# EasyEDA Pro project portalhub.epro

# Schematic Schematic1
Board Name: Board1; Create Date: 2026-05-30; Page Name: P1; Project Name: usbgobrr; Schematic Name: Schematic1; Update Date: 2026-05-30; Company: EasyEDA.com; Page Size: A4; Version: V1.0
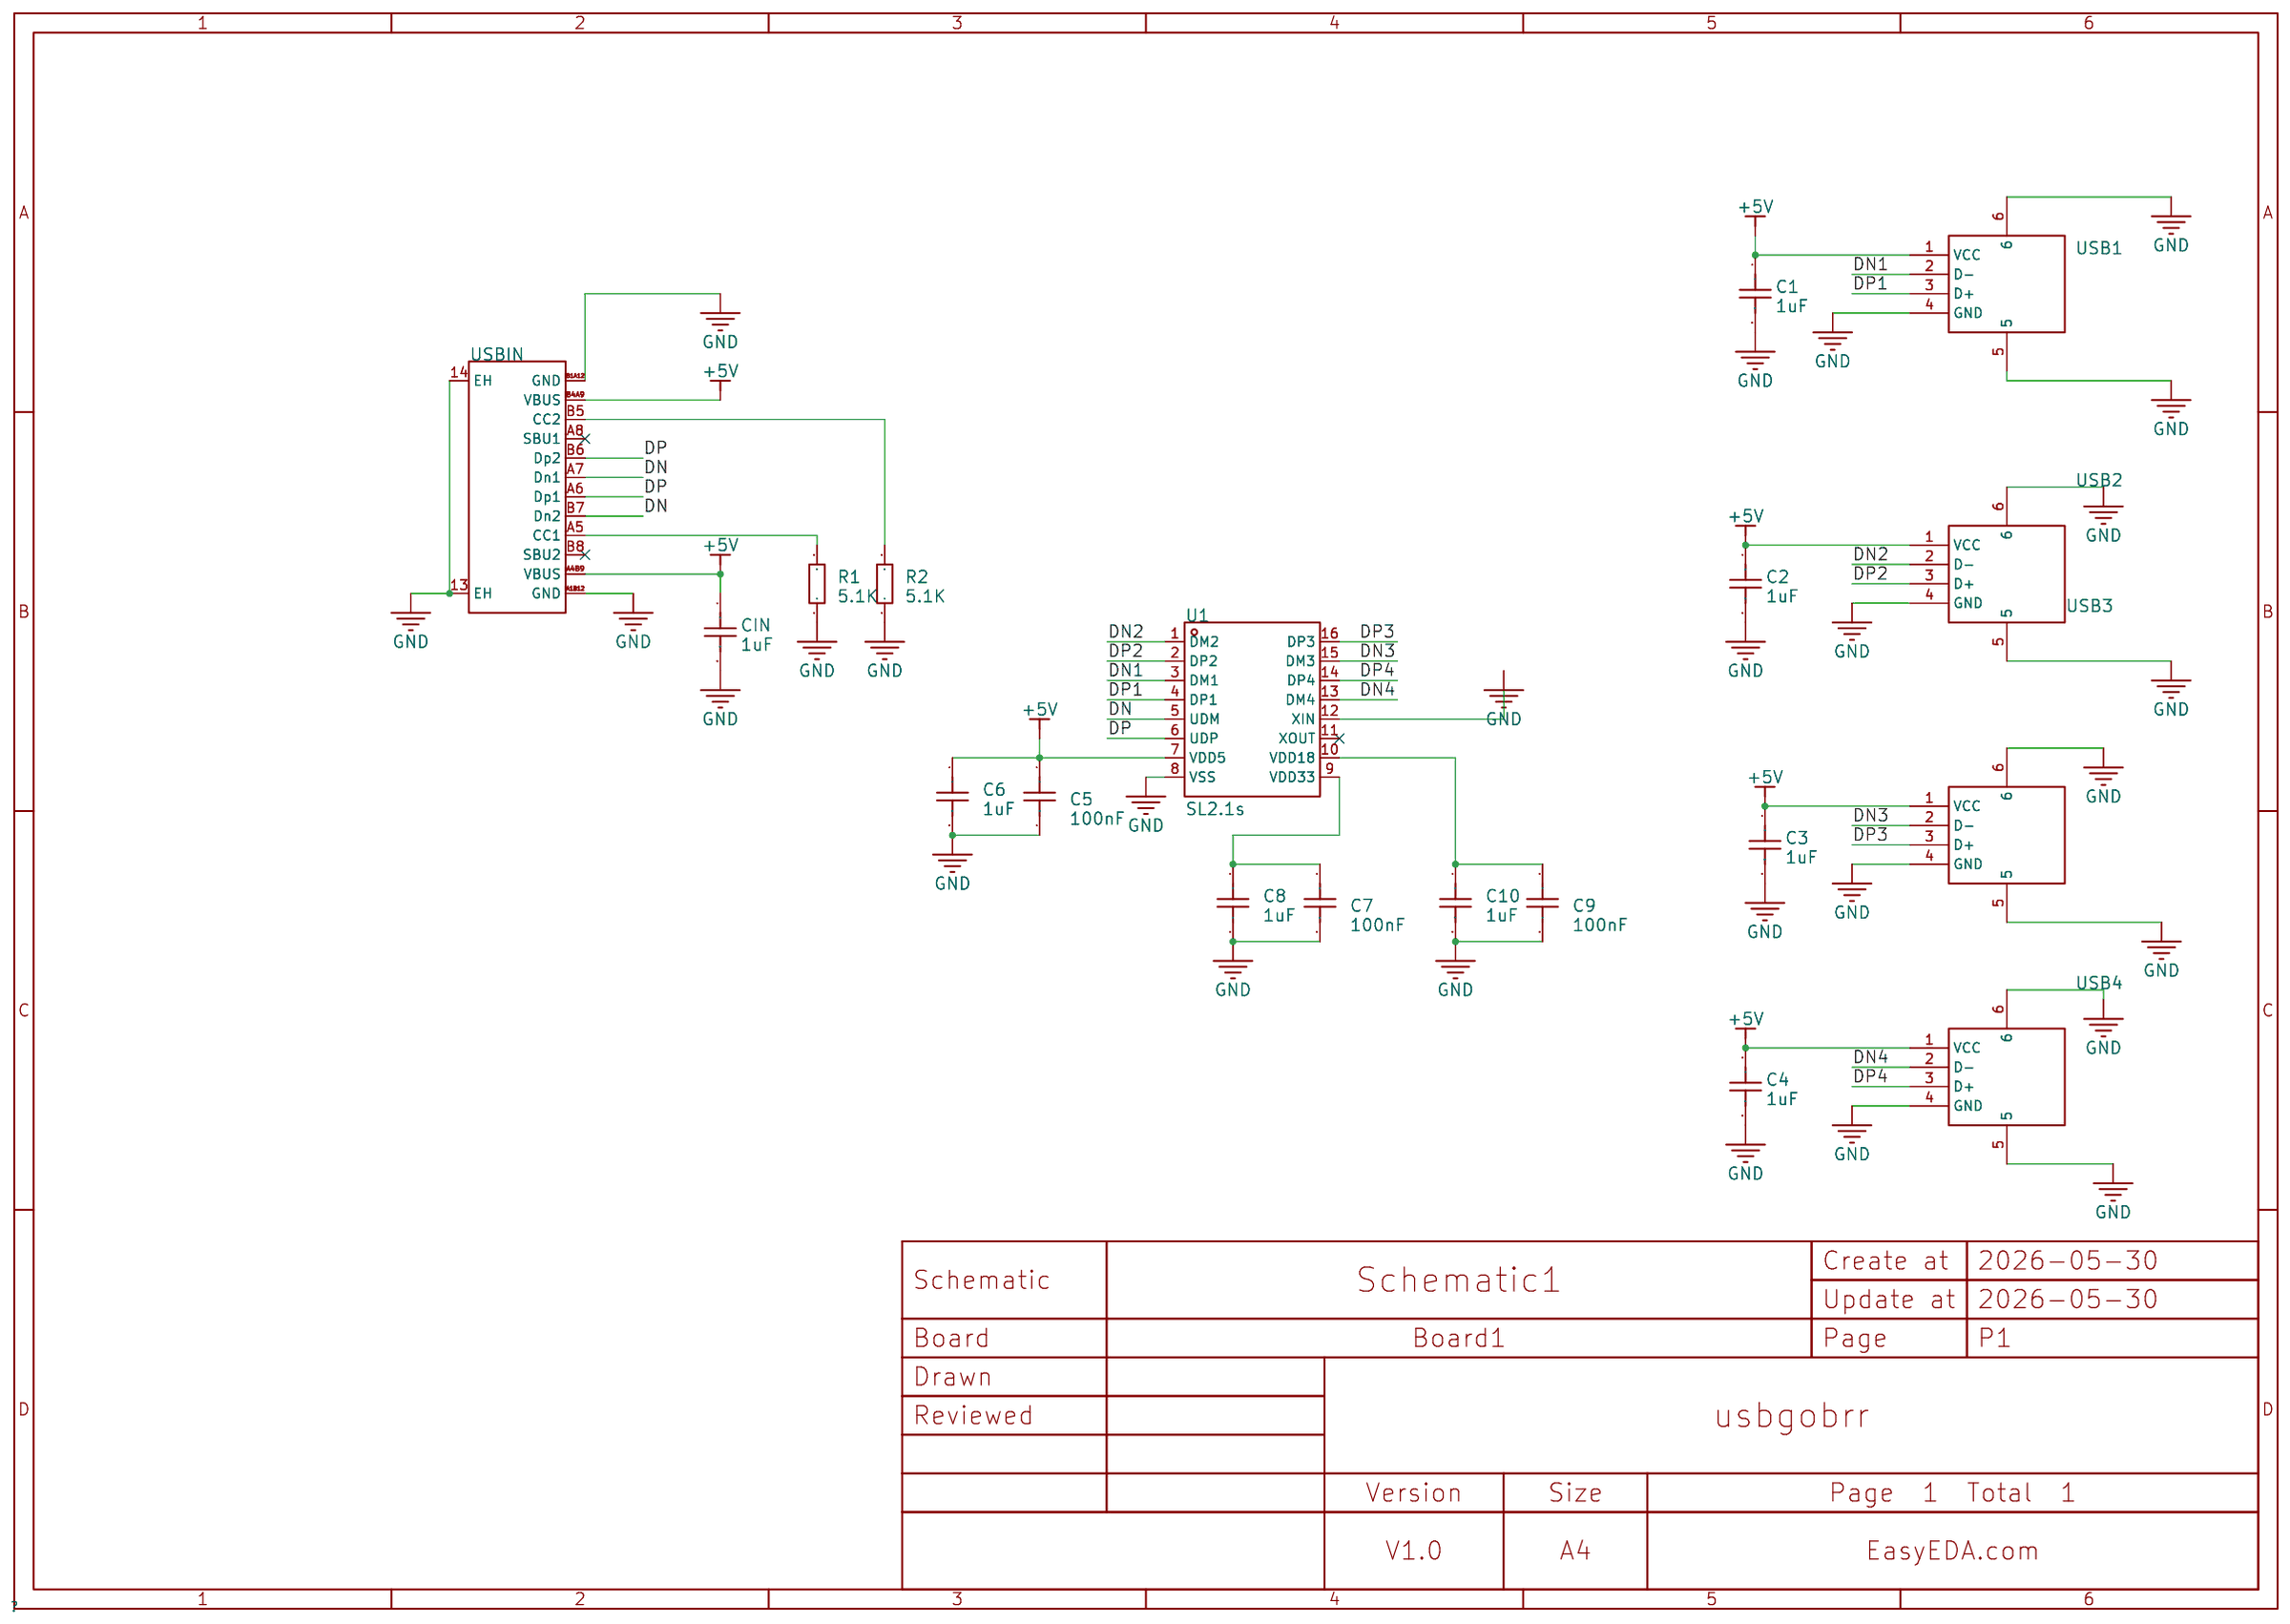
[diagram p0: schematic sheet]

## Parts
C1  1uF  [C0603]
C2  1uF  [C0603]
C3  1uF  [C0603]
C4  1uF  [C0603]
C5  100nF  [C0603]
C6  1uF  [C0603]
C7  100nF  [C0603]
C8  1uF  [C0603]
C9  100nF  [C0603]
C10  1uF  [C0603]
CIN  1uF  [C0603]
R1  5.1K  [R0603]
R2  5.1K  [R0603]
U1  SL2.1s  [SSOP-16_L4.6-W2.6-P0.53-LS4.0-BL]
USB1  10.0 QHHTZB6.3  [USB-A-TH_10.0QHHTZB6.3]
USB2  10.0 QHHTZB6.3  [USB-A-TH_10.0QHHTZB6.3]
USB3  10.0 QHHTZB6.3  [USB-A-TH_10.0QHHTZB6.3]
USB4  10.0 QHHTZB6.3  [USB-A-TH_10.0QHHTZB6.3]
USBIN  TYPE-C 16PIN 2MD(073)  [USB-C-SMD_TYPE-C-16PIN-2MD-073]

## Library data of the parts
C1-C10 CIN = CAP_0603: Supplier Footprint: 0603
R1 R2 = Res_0603: Supplier Footprint: 0603
U1 = SL2.1s: type:Hub USB Protocol:USB 2.0 Data Rate:- Voltage - Supply:4V~5.25V Voltage - Supply:4V~5.25V Operating Temperature:0℃~+70℃ Operating Temperature:0℃~+70℃ Memory Interface:- Current - Supply:120mA Quiescent Supply Current:2.5mA Number of Channels:4; LCSC Part Name: USB2.0 HUB控制器集成电路; Supplier Part: C2684433; Manufacturer: CoreChips(和芯润德); Supplier Footprint: SSOP-16; JLCPCB Part Class: Extended Part; Datasheet: https://item.szlcsc.com/datasheet/SL2.1s/2782346.html; Supplier: LCSC; type: Hub; USB Protocol: USB 2.0; Voltage - Supply: 4V~5.25V; Operating Temperature: 0℃~+70℃; Current - Supply: 120mA; Quiescent Supply Current: 2.5mA; Number of Channels: 4
USB1-USB4 = 10.0 QHHTZB6.3: Connector Type:Type-A Protocol Standard:USB 2.0 Gender:Female Mounting Type:Surface Mount, Right Angle Number of Contacts:4P Number of Ports:1 Current Rating-Power:1.5A Voltage Rating:30V Connect-Disconnect Life:5,000 times Supplementary Features:- Center; LCSC Part Name: 壳长10.0mm; Supplier Part: C668591; Manufacturer: SHOU HAN(首韩); Supplier Footprint: SMD; JLCPCB Part Class: Extended Part; Datasheet: https://item.szlcsc.com/datasheet/10.0%2520QHHTZB6.3/698534.html; Supplier: LCSC; Connector Type: Type-A; Protocol Standard: USB 2.0; Gender: Female; Mounting Type: Surface Mount, Right Angle; Number of Contacts: 4P; Number of Ports: 1; Current Rating-Power: 1.5A; Voltage Rating: 30V; Connect-Disconnect Life: 5,000 times; Length: 10mm; Detection color: Black; Operating Temperature: -25℃~+85℃
USBIN = TYPE-C 16PIN 2MD(073): Connector Type:Type-C Protocol Standard:- Gender:Female Mounting Type:Surface Mount, Right Angle Number of Contacts:16P Number of Ports:1 Current Rating-Power:3A Voltage Rating:5V Connect-Disconnect Life:10,000 Cycles Supplementary Features:- Center Heigh; LCSC Part Name: Type-C 母 卧贴; Supplier Part: C2765186; Manufacturer: SHOU HAN(首韩); Supplier Footprint: SMD; JLCPCB Part Class: Extended Part; Datasheet: https://item.szlcsc.com/datasheet/TYPE-C%252016PIN%25202MD(073)/2901843.html; Supplier: LCSC; Connector Type: Type-C; Gender: Female; Mounting Type: Surface Mount, Right Angle; Number of Contacts: 16P; Number of Ports: 1; Current Rating-Power: 3A; Voltage Rating: 5V; Connect-Disconnect Life: 10,000 Cycles; Detection color: Black; Operating Temperature: -25℃~+85℃

## Nets
+5V: C1.1 C2.1 C3.1 C4.1 C5.1 C6.1 CIN.1 U1.7(VDD5) USB1.1(VCC) USB2.1(VCC) USB3.1(VCC) USB4.1(VCC) USBIN.A4B9(VBUS) USBIN.B4A9(VBUS)
GND: C1.2 C2.2 C3.2 C4.2 C5.2 C6.2 C7.2 C8.2 C9.2 C10.2 CIN.2 R1.1 R2.1 U1.8(VSS) U1.12(XIN) USB1.4(GND) USB1.5 USB1.6 USB2.4(GND) USB2.5 USB2.6 USB3.4(GND) USB3.5 USB3.6 USB4.4(GND) USB4.5 USB4.6 USBIN.13(EH) USBIN.14(EH) USBIN.A1B12(GND) USBIN.B1A12(GND)
DN: U1.5(UDM) USBIN.A7(Dn1) USBIN.B7(Dn2)
DN1: U1.3(DM1) USB1.2(D-)
DN2: U1.1(DM2) USB2.2(D-)
DN3: U1.15(DM3) USB3.2(D-)
DN4: U1.13(DM4) USB4.2(D-)
DP: U1.6(UDP) USBIN.A6(Dp1) USBIN.B6(Dp2)
DP1: U1.4(DP1) USB1.3(D+)
DP2: U1.2(DP2) USB2.3(D+)
DP3: U1.16(DP3) USB3.3(D+)
DP4: U1.14(DP4) USB4.3(D+)
$1N1063: R2.2 USBIN.B5(CC2)
$1N1068: R1.2 USBIN.A5(CC1)
$1N2091: C7.1 C8.1 U1.9(VDD33)
$1N2107: C9.1 C10.1 U1.10(VDD18)

Not connected (* = marked no-connect by the designer): U1 11(XOUT)*; USBIN A8(SBU1)* B8(SBU2)*

# Board PCB1
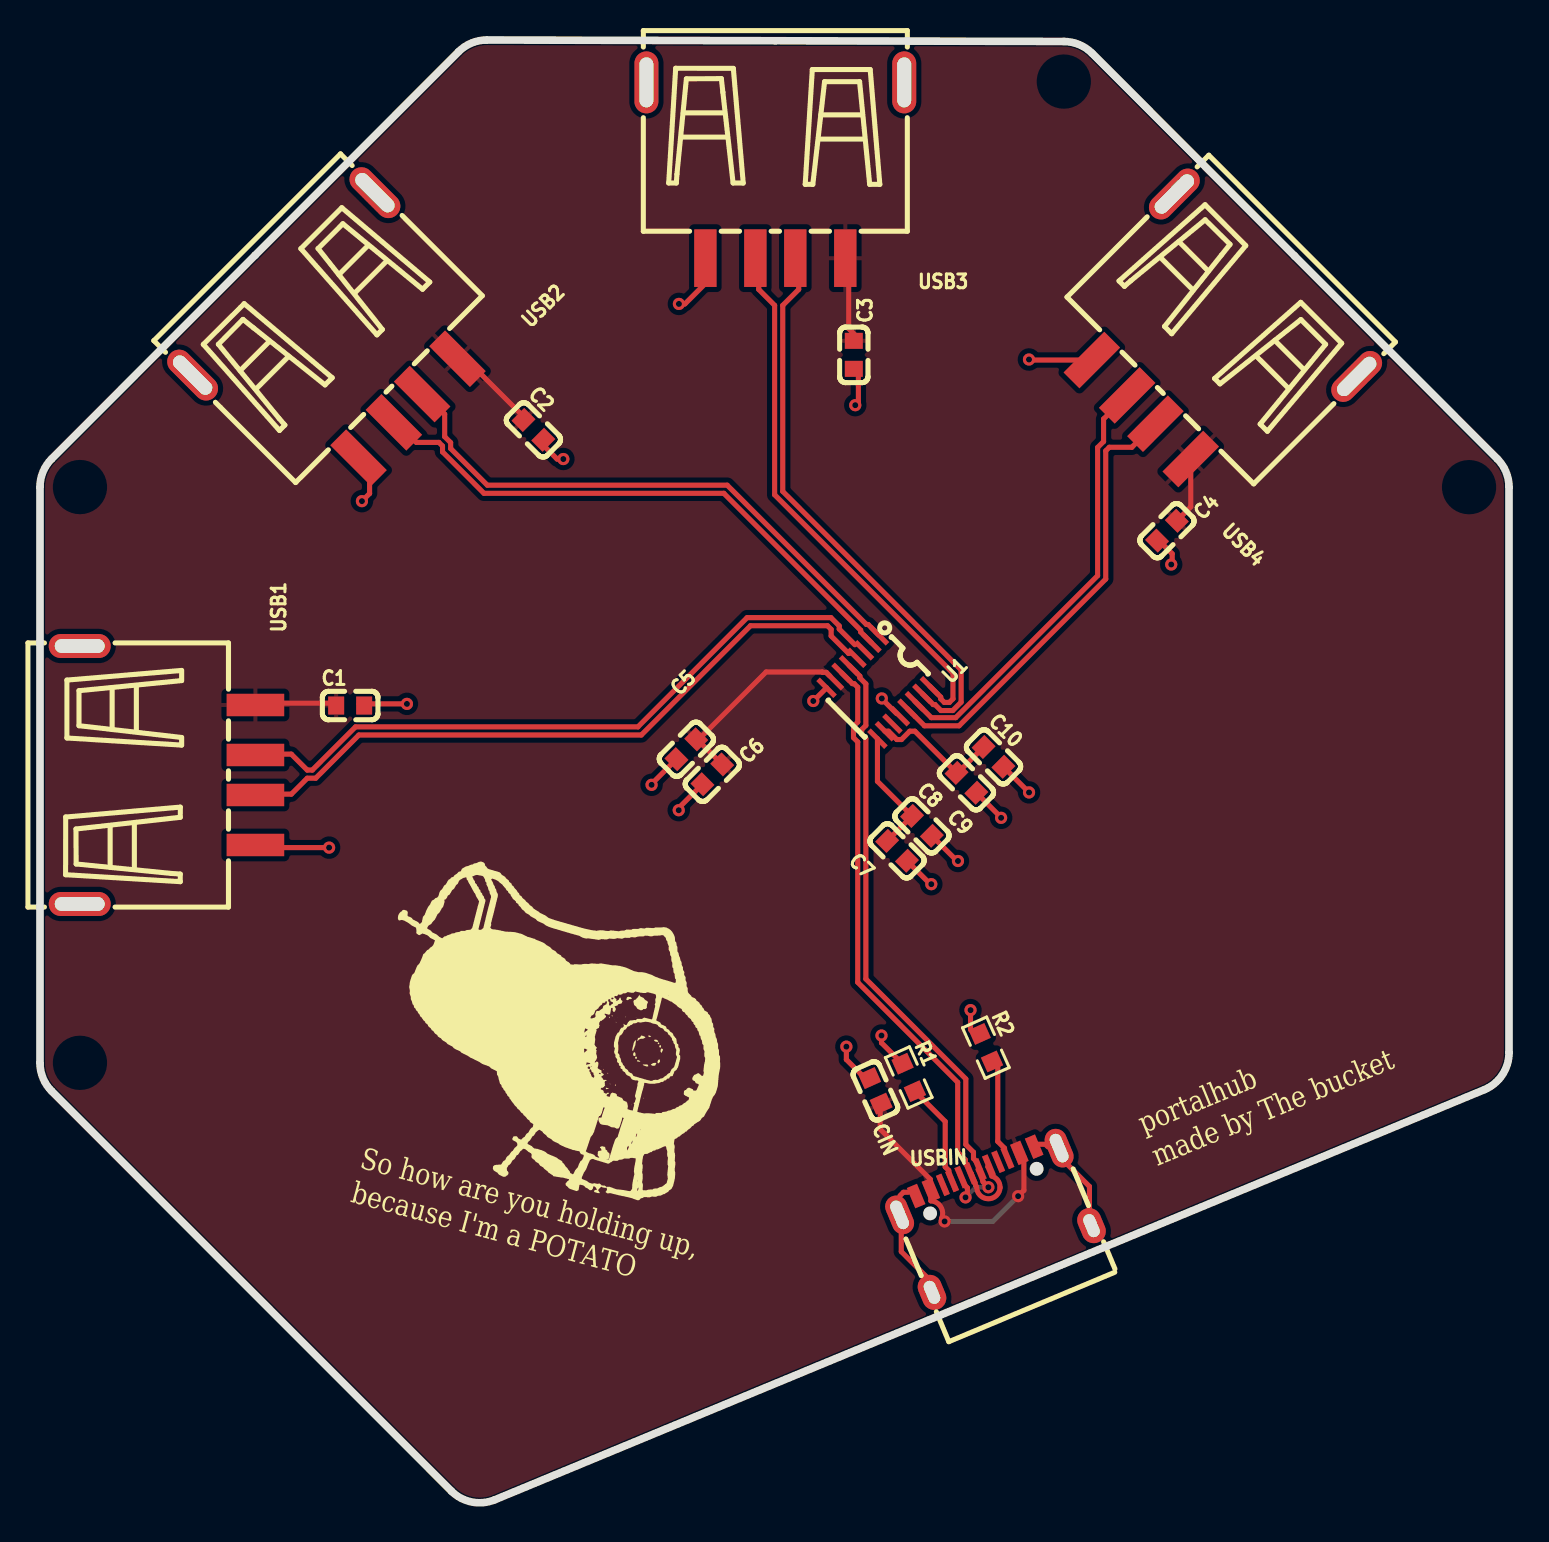
[diagram p1: board, top side]
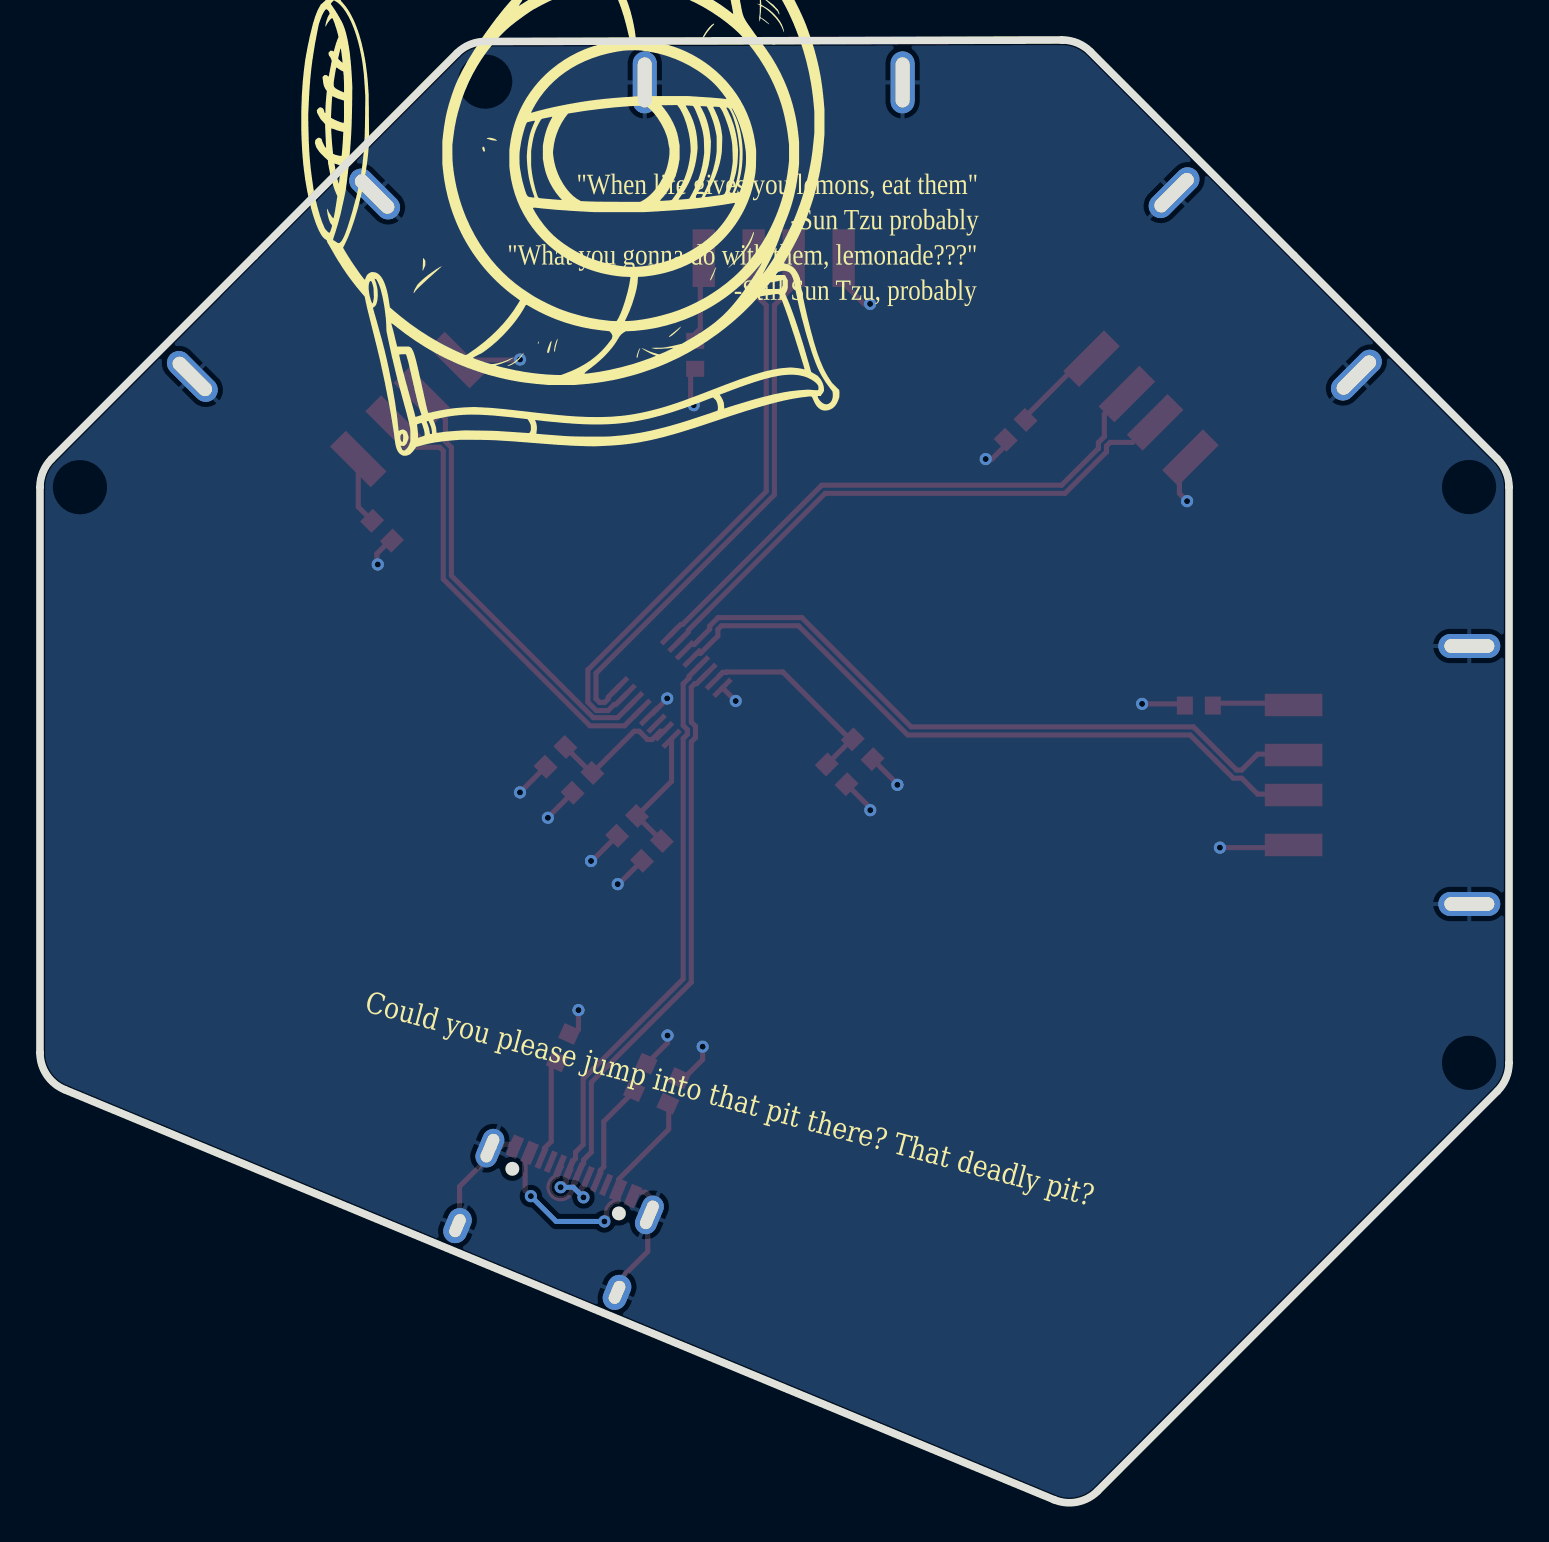
[diagram p2: board, bottom side, seen from below]

Outline 73.5 x 73.1 mm; copper layers: Top Layer, Bottom Layer. Coordinates in mm from the lower left corner of the outline.
Outline path: 0,50.75 arc(0.15,51.51) 0.59,52.16 10.77,62.34 20.94,72.52 arc(21.59,72.95) 22.36,73.1 36.79,73.07 51.23,73.03 arc(51.99,72.88) 52.64,72.44 72.91,52.16 arc(73.35,51.51) 73.5,50.74 73.5,22.47 arc(73.16,21.36) 72.27,20.62 22.76,0.11 arc(21.61,0) 20.58,0.55 0.59,20.54 arc(0.15,21.19) 0,21.96 0,50.75
Stack: Top Layer 0.035mm / Dielectric1 1.51mm FR4 er 4.5 / Bottom Layer 0.035mm

## Design rules (mm)
net DN2: DP3
net DP2: DP3
net DN1: DP2
net DP1: DP2
net DN: DP1
net DP: DP1
net DN4: DP5
net DP4: DP5
net DN3: DP4
net DP3: DP4
spacing copperThickness1oz (default): track to track 0.102, other pairs 0.152 to 0.3
spacing copperThickness2oz: track to track 0.203, other pairs 0.152 to 0.3
spacing Plane_innerPlane: track to track 0.102, other pairs 0.152 to 0.3
spacing Copper_copperRegion: track to track 0.102, other pairs 0.152 to 0.3
track width copperThickness1oz (default): min 0.127, default 0.254, max 2.54
track width copperThickness2oz: min 0.203, default 0.254, max 2.54
differential pair differentialPair (default): width min 0.127, default 0.254, max 2.54; gap min 0.152, default 0.152
pour e171 uses Copper_copperRegion
pour e216 uses Copper_copperRegion

## Placement (name value [footprint] x y rotation side)
C1  1uF  [C0603]  15.52 39.83 0 top
C2  1uF  [C0603]  24.69 53.61 315 top
C3  1uF  [C0603]  40.72 57.36 270 top
C4  1uF  [C0603]  56.38 48.57 225 top
C5  100nF  [C0603]  32.34 37.64 225 top
C6  1uF  [C0603]  33.64 36.39 225 top
C7  100nF  [C0603]  42.88 32.56 315 top
C8  1uF  [C0603]  44.13 33.81 315 top
C9  100nF  [C0603]  46.35 35.96 315 top
C10  1uF  [C0603]  47.71 37.26 315 top
CIN  1uF  [C0603]  41.8 20.56 114.1 top
R1  5.1K  [R0603]  43.47 21.23 294.1 top
R2  5.1K  [R0603]  47.33 22.72 294.1 top
U1  SL2.1s  [SSOP-16_L4.6-W2.6-P0.53-LS4.0-BL]  41.94 40.75 225 top
USB1  10.0 QHHTZB6.3  [USB-A-TH_10.0QHHTZB6.3]  6.38 36.35 270 top
USB2  10.0 QHHTZB6.3  [USB-A-TH_10.0QHHTZB6.3]  15.31 57.8 225 top
USB3  10.0 QHHTZB6.3  [USB-A-TH_10.0QHHTZB6.3]  36.79 66.59 180 top
USB4  10.0 QHHTZB6.3  [USB-A-TH_10.0QHHTZB6.3]  58.21 57.73 135 top
USBIN  TYPE-C 16PIN 2MD(073)  [USB-C-SMD_TYPE-C-16PIN-2MD-073]  47.7 14.34 22.7 top

## Footprints (pads in the part's own frame, mm; a bottom-side part is the same pattern mirrored in y, then rotated)
C0603
  rect 0.8x0.9 smd: 1(-0.7,0) 2(0.7,0)
R0603
  rect 0.806x0.864 smd: 1(-0.753,0) 2(0.753,0)
SSOP-16_L4.6-W2.6-P0.53-LS4.0-BL
  rect 0.25x1.2 smd: 1(-1.855,-1.8) 2(-1.325,-1.8) 3(-0.795,-1.8) 4(-0.265,-1.8) 5(0.265,-1.8) 6(0.795,-1.8) 7(1.325,-1.8) 8(1.855,-1.8) 9(1.855,1.8) 10(1.325,1.8) 11(0.795,1.8) 12(0.265,1.8) 13(-0.265,1.8) 14(-0.795,1.8) 15(-1.325,1.8) 16(-1.855,1.8)
USB-A-TH_10.0QHHTZB6.3
  rect 1.12x2.88 smd: 1(-3.5,4.395) 2(-1,4.395) 3(1,4.395) 4(3.5,4.395)
  oval 1.2x3.1 hole 0.7x2.5: 5(-6.45,-4.395) 6(6.45,-4.395)
USB-C-SMD_TYPE-C-16PIN-2MD-073
  oval 1.1x2 hole 0.6x1.5: 13(-4.325,1.825) 14(4.325,1.825)
  oval 1.2x1.8 hole 0.6x1.2: 13(-4.325,-2.375) 14(4.325,-2.375)
  rect 0.55x1.1 smd: A1B12(-3.2,2.375) A4B9(-2.4,2.375) B1A12(3.2,2.375) B4A9(2.4,2.375)
  rect 0.3x1.1 smd: A5(-1.25,2.375) A6(-0.25,2.375) A7(0.25,2.375) A8(1.25,2.375) B5(1.75,2.375) B6(0.75,2.375) B7(-0.75,2.375) B8(-1.75,2.375)

## Nets
As in the schematic.

Pads without a net: U1 11; USBIN A8 B8

## Via types
v1: diameter 0.61, hole 0.305, Top Layer to Bottom Layer, 23 vias

## Routing (per net, layer and track width the routed paths; a pad name or vN(x,y) marks a point on that pad's centre or on a via; arc(x,y) is an arc through that point)
+5V: length 36.8
  Top Layer w0.254: 40.77,58.36 40.46,58.67 40.46,61.57 ; 39.52,41.3 39.34,41.49 39.15,41.49 39.14,41.5 36.33,41.5 32.92,38.09 ; 32.92,38.09 C6.1 ; 32.92,38.09 32.92,38.09 ; USBIN.A4B9 44.57,15.06 arc(45.07,14.76) 45.11,14.18 v1(45.26,14.03) ; 24.01,54.46 21.78,56.69 20.95,56.69 ; 44.54,15.64 44.54,16.14 42.04,18.64 42.04,19.84 ; C4.1 57.58,49.76 USB4.1 ; 49,17.46 49.23,17.23 49.23,15.58 v1(48.94,15.29) ; 12.09,39.94 14.53,39.94 14.57,39.91
  Bottom Layer w0.254: v1(45.26,14.03) 47.67,14.03 v1(48.94,15.29)
GND: length 45.9
  Top Layer w0.254: 43.38,32.06 44.53,30.91 ; v1(46.56,24.6) 46.56,23.62 47.05,23.13 ; 16.49,52.24 16.49,50.43 v1(16.11,50.05) ; v1(48.09,34.21) 48.09,34.23 C9.2 ; v1(49.48,57.13) 49.51,57.1 USB4.4 ; 40.95,56.49 40.95,55 v1(40.79,54.84) ; 43.09,14.19 43.09,12.52 44.63,10.99 USBIN.13 ; C6.2 31.96,34.7 v1(31.96,34.59) ; C8.2 45.88,32.05 v1(45.93,32.05) ; 42.97,22.09 42.1,22.96 v1(42.1,23.32) ; 11.61,32.72 v1(14.47,32.72) ; 42.25,40.09 42.25,40.03 42.86,39.42 ; v1(31.97,59.91) 32.27,59.91 33.45,61.09 33.45,61.35 33.27,61.53 ; v1(26.18,52.15) 25.87,52.15 25.02,53 ; 56.65,46.97 56.65,47.41 55.86,48.2 ; 51.08,17.2 52.51,15.78 52.51,13.92 USBIN.14 ; C10.2 v1(49.48,35.48) ; 41.49,20.98 40.35,22.12 v1(40.35,22.77) ; 43.03,15.31 43.2,15.49 43.43,15.49 ; 31.84,37.14 30.56,35.86 ; 49.63,17.89 50.3,17.89 50.43,17.76 ; 39.36,40.71 38.7,40.05 ; 15.96,39.91 v1(18.36,39.91)
  Bottom Layer w0.254: v1(16.11,50.05) 16.14,50.05 ; v1(14.47,32.72) 14.47,32.79
  vias: v1(30.6,35.86) v1(38.69,40.05) v1(42.12,40.18) v1(44.59,30.89) v1(56.6,46.88)
DN: length 30.8
  Top Layer w0.254: 40.48,41.84 41.02,41.29 41.02,41.21 41.32,40.91 41.32,38.83 41.11,38.62 41.11,38.39 41.32,38.18 41.32,26.15 46.32,21.15 46.32,17.87 46.71,17.49 46.71,17.17 46.85,17.03 ; USBIN.A7 46.94,16.63 47.17,16.09 arc(47.18,16.05) 47.19,16 v1(47.45,15.74) ; 46.26,15.85 46.4,15.71 46.4,15.33 v1(46.31,15.23)
  Bottom Layer w0.254: v1(47.45,15.74) 46.81,15.74 v1(46.31,15.23)
DN1: length 34
  Top Layer w0.254: 10.88,37.39 12.58,37.39 13.37,36.6 13.63,36.6 15.79,38.76 29.92,38.76 35.38,44.22 39.57,44.22 39.99,43.8 39.99,43.65 40.77,42.87
DN2: length 28.8
  Top Layer w0.254: 19.07,55.58 20.25,54.4 20.25,53.27 20.55,52.97 20.55,52.68 22.38,50.84 34.38,50.84 41.35,43.88 41.44,43.88 U1.1
DN3: length 28.8
  Top Layer w0.254: 37.96,62.33 37.96,60.63 37.16,59.84 37.16,50.53 46.09,41.61 46.09,39.99 45.67,39.57 45.08,39.57 44.78,39.87 44.69,39.87 U1.15
DN4: length 22.8
  Top Layer w0.254: U1.13 44.25,38.81 45.98,38.81 53.32,46.15 53.32,52.56 53.5,52.74 54.63,52.74 USB4.2
DP: length 31.4
  Top Layer w0.254: 46.39,16.83 46.3,16.93 46.3,17.11 45.92,17.49 45.92,20.99 40.91,25.99 40.91,38.01 40.7,38.22 40.7,38.79 40.91,39 40.91,40.74 40.73,40.92 40.65,40.92 U1.6 ; 46.56,16.44 46.58,16.44 46.78,15.96 arc(46.81,15.85) 46.87,15.75 arc(47.44,15.15) 48.03,15.73 arc(47.92,16.08) 47.62,16.3 47.43,16.77 USBIN.B6
DP1: length 33.9
  Top Layer w0.254: 40.5,42.43 40.45,42.43 39.58,43.3 39.58,43.63 39.4,43.81 35.55,43.81 30.08,38.35 15.95,38.35 13.8,36.19 13.37,36.19 12.58,35.39 10.88,35.39
DP2: length 28.8
  Top Layer w0.254: U1.2 41.06,43.5 41.06,43.59 34.22,50.44 22.21,50.44 20.14,52.51 20.14,52.8 19.96,52.98 18.83,52.98 17.65,54.16
DP3: length 27.8
  Top Layer w0.254: U1.16 45.07,40.25 45.07,40.16 45.25,39.98 45.5,39.98 45.68,40.16 45.68,41.44 36.76,50.36 36.76,59.84 35.96,60.63 35.96,62.33
DP4: length 22
  Top Layer w0.254: U1.14 44.6,39.22 45.82,39.22 52.92,46.32 52.92,52.73 53.21,53.03 53.21,54.15 USB4.3
$1N1063: length 4.6
  Top Layer w0.254: 47.82,21.98 47.92,21.87 47.92,18.03 48.26,17.69 48.26,17.58
$1N1068: length 4.8
  Top Layer w0.254: R1.2 45.29,19.02 45.29,16.75 45.47,16.58 45.47,16.45
$1N2091: length 6.3
  Top Layer w0.254: 41.9,38.17 41.9,36.03 C8.1 43.63,34.3 42.39,33.05
$1N2107: length 6.7
  Top Layer w0.254: C10.1 45.92,36.46 C9.1 43.77,38.54 43.52,38.54 43.1,38.12 42.87,38.12 42.45,38.54 U1.10

## Copper pours and planes (outline as drawn; the poured copper is in the pictures)
+5V on Top Layer: -10.86,79.61 86.37,79.61 86.37,-3.34 -10.86,-3.34
GND on Bottom Layer: -15.15,79.97 77.62,79.97 77.62,-7.04 -15.15,-7.04

## Text on the board
Bottom Silkscreen Layer: "When life gives you lemons, eat them" / -Sun Tzu probably / "What you gonna do with them, lemonade???" / -Still Sun Tzu, probably | Could you please jump into that pit there? That deadly pit?
Top Silkscreen Layer: portalhub / made by The bucket | So how are you holding up, / because I'm a POTATO
